# EasyEDA schematic SCH_junwoo-board_2025-07-26.json
TITLE: Junwoo_board; REV: 1.0; Date: 2025-03-15; Sheet: 1/1; Drawn By: junlee2577; Company: Lee Jun Woo
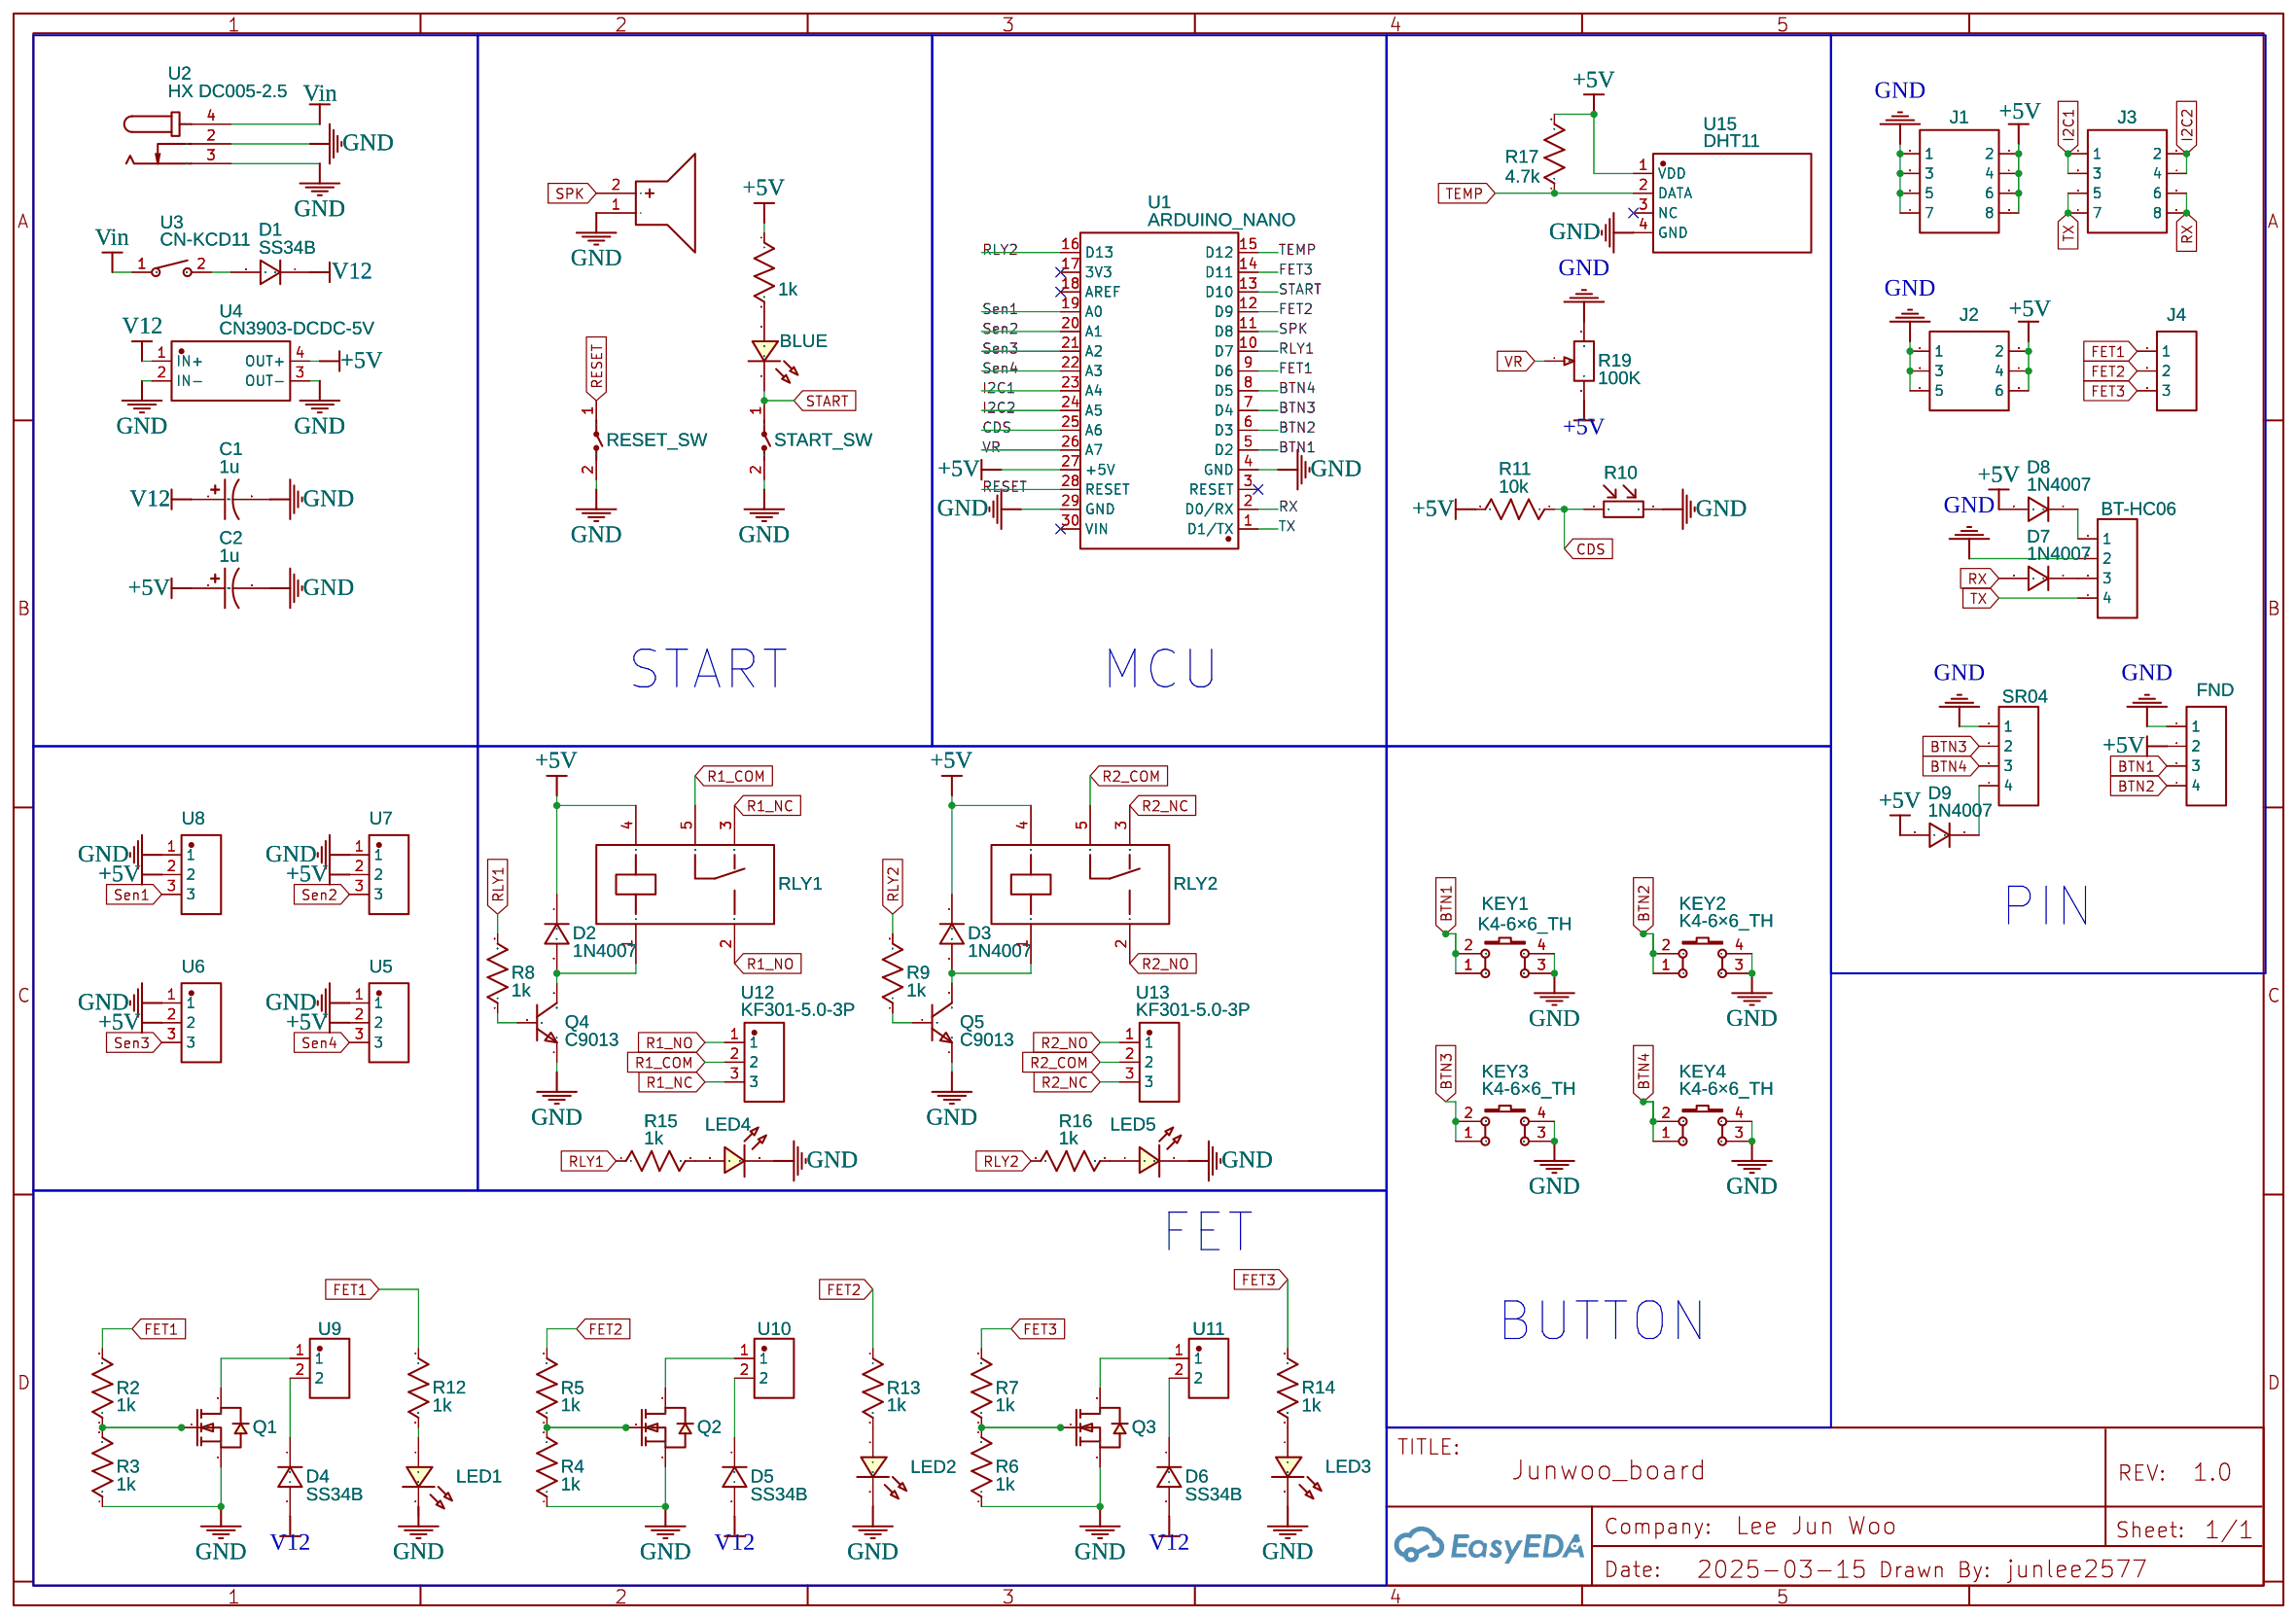
[diagram p0: schematic sheet]

## Parts
BLUE  LED-TH-3mm_B  [LED-TH_BD3.0_BLUE]
BT-HC06  HDR-M-2.54_1x4  [HDR-M-2.54_1X4]
BUZZER1  BUZZER  [BUZ-TH_BD12.0-P6.00-D0.9-RD]
C1  1u  [CAP-D6.3×F2.5]
C2  1u  [CAP-D6.3×F2.5]
D1  SS34B  [SMB_L4.6-W3.6-LS5.3-RD]
D2  1N4007  [DO-41_BD2.4-L4.7-P8.70-D0.9-RD]
D3  1N4007  [DO-41_BD2.4-L4.7-P8.70-D0.9-RD]
D4  SS34B  [SMB_L4.6-W3.6-LS5.3-RD]
D5  SS34B  [SMB_L4.6-W3.6-LS5.3-RD]
D6  SS34B  [SMB_L4.6-W3.6-LS5.3-RD]
D7  1N4007  [DO-41_BD2.4-L4.7-P8.70-D0.9-RD]
D8  1N4007  [DO-41_BD2.4-L4.7-P8.70-D0.9-RD]
D9  1N4007  [DO-41_BD2.4-L4.7-P8.70-D0.9-RD]
FND  HDR-M-2.54_1x4  [HDR-M-2.54_1X4]
J1  HDR-M-2.54_2x4  [HDR-M-2.54_2X4]
J2  HDR-M-2.54_2x3  [HDR-M-2.54_2X3]
J3  HDR-M-2.54_2x4  [HDR-M-2.54_2X4]
J4  HDR-M-2.54_1x3  [HDR-M-2.54_1X3]
KEY1  K4-6×6_TH  [KEY-TH_4P-L6.0-W6.0-P4.50-LS6.5]
KEY2  K4-6×6_TH  [KEY-TH_4P-L6.0-W6.0-P4.50-LS6.5]
KEY3  K4-6×6_TH  [KEY-TH_4P-L6.0-W6.0-P4.50-LS6.5]
KEY4  K4-6×6_TH  [KEY-TH_4P-L6.0-W6.0-P4.50-LS6.5]
LED1  LED-TH-5mm_B  [LED-TH_BD5.0_BLUE]
LED2  LED-TH-5mm_B  [LED-TH_BD5.0_BLUE]
LED3  LED-TH-5mm_B  [LED-TH_BD5.0_BLUE]
LED4  LED-TH-5mm_B  [LED-TH_BD5.0_BLUE]
LED5  LED-TH-5mm_B  [LED-TH_BD5.0_BLUE]
Q1  IRLZ44ZPBF  [TO-220-3_L10.0-W4.5-P2.54-L]
Q2  IRLZ44ZPBF  [TO-220-3_L10.0-W4.5-P2.54-L]
Q3  IRLZ44ZPBF  [TO-220-3_L10.0-W4.5-P2.54-L]
Q4  C9013  [2SC9013-ED]
Q5  C9013  [2SC9013-ED]
R1  1k  [R_AXIAL-0.4]
R2  1k  [R_AXIAL-0.4]
R3  1k  [R_AXIAL-0.4]
R4  1k  [R_AXIAL-0.4]
R5  1k  [R_AXIAL-0.4]
R6  1k  [R_AXIAL-0.4]
R7  1k  [R_AXIAL-0.4]
R8  1k  [R_AXIAL-0.4]
R9  1k  [R_AXIAL-0.4]
R10  GL5528(10-20)_C520869  [RES-TH_L5.1-W4.3-P3.40-D0.5]
R11  10k  [R_AXIAL-0.4]
R12  1k  [R_AXIAL-0.4]
R13  1k  [R_AXIAL-0.4]
R14  1k  [R_AXIAL-0.4]
R15  1k  [R_AXIAL-0.4]
R16  1k  [R_AXIAL-0.4]
R17  4.7k  [R_AXIAL-0.4]
R19  100K  [RV09AF]
RESET_SW  TS-1001-AR04326  [SW-TH_L6.0-W3.5-P6.50]
RLY1  5V-12V SRD05VDCSLC  [RELAY-TH_SRD-XXVDC-XL-C]
RLY2  5V-12V SRD05VDCSLC  [RELAY-TH_SRD-XXVDC-XL-C]
SR04  HDR-M-2.54_1x4  [HDR-M-2.54_1X4]
START_SW  TS-1001-AR04326  [SW-TH_L6.0-W3.5-P6.50]
U1  ARDUINO_NANO  [COMM-TH_ARDUINO_NANO]
U2  HX DC005-2.5  [DC-IN-TH_HX-DC005-2.5]
U3  CN-KCD11  [KEY-TH_CN-KCD11]
U4  CN3903-DCDC-5V  [CN3903 DCDC 5V]
U5  KF350-3.5-3P  [CONN-TH_3P-P3.50_KF350-3.5-3P]
U6  KF350-3.5-3P  [CONN-TH_3P-P3.50_KF350-3.5-3P]
U7  KF350-3.5-3P  [CONN-TH_3P-P3.50_KF350-3.5-3P]
U8  KF350-3.5-3P  [CONN-TH_3P-P3.50_KF350-3.5-3P]
U9  KF301-5.0-2P  [CONN-TH_P5.00_KF301-5.0-2P]
U10  KF301-5.0-2P  [CONN-TH_P5.00_KF301-5.0-2P]
U11  KF301-5.0-2P  [CONN-TH_P5.00_KF301-5.0-2P]
U12  KF301-5.0-3P  [CONN-TH_3P-P5.00_KF301-5.0-3P]
U13  KF301-5.0-3P  [CONN-TH_3P-P5.00_KF301-5.0-3P]
U15  DHT11  [SENSOR-TH_DHT11]

## Library data of the parts
BLUE = LED-TH-3mm_B: Manufacturer: EVERLIGHT(台湾亿光); Manufacturer Part: 204-10SUBC/S400-A4; Supplier Part: C86881; Supplier: LCSC; Contributor: LCEDA_Lib
BT-HC06 FND SR04 = HDR-M-2.54_1x4: Supplier Part: C124378; Supplier: LCSC; Contributor: LCEDA_Lib
BUZZER1 = BUZZER: Contributor: lcsc; Supplier: LCSC; Supplier Part: C9900014030; Manufacturer: null; Manufacturer Part: buzzer; JLCPCB Part Class: Extended Part
C1 C2 = CE_TH_D6.3×F2.5_US: Contributor: LCEDA_Lib
D1 D4-D6 = SS34B: Contributor: LCSC; Supplier Part: C169415; Supplier: LCSC; Manufacturer: 晶导微电子; JLCPCB Part Class: Extended Part
D2 D3 D7-D9 = 1N4007: Supplier: LCSC; Manufacturer: SEMTECH; Supplier Part: C106903; Contributor: LCEDA_Lib
J1 J3 = HDR-M-2.54_2x4: Supplier Part: C58363; Supplier: LCSC; Contributor: LCEDA_Lib
J2 = HDR-M-2.54_2x3: Supplier Part: C65114; Supplier: LCSC; Contributor: LCEDA_Lib
J4 = HDR-M-2.54_1x3: Supplier Part: C180248; Supplier: LCSC; Contributor: LCEDA_Lib
KEY1-KEY4 = K4-6×6_TH: Supplier: LCSC; Supplier Part: C136684; Manufacturer: 韩国韩荣; Manufacturer Part: K2-1102DP-E4SW-04; Contributor: LCEDA_Lib
LED1-LED5 = LED-TH-5mm_B: Supplier: LCSC; Contributor: LCEDA_Lib
Q1-Q3 = IRLZ44ZPBF: Contributor: LCSC; Supplier: LCSC; Supplier Part: C538200; Manufacturer: Infineon(英飞凌); JLCPCB Part Class: Extended Part
Q4 Q5 = C9013: Contributor: Fk229; libConvert: Yes; Add into BOM: Yes
R1-R9 R11-R17 = R_AXIAL-0.4_US: Contributor: LCEDA_Lib
R10 = GL5528(10-20)_C520869: Contributor: LCSC; Supplier: LCSC; Supplier Part: C520869; Manufacturer: JCHL(晶创和立); Manufacturer Part: GL5528(10-20); JLCPCB Part Class: Extended Part
R19 = RV09AF_schütze: Manufacturer: JML; Manufacturer Part: Potentiometer WH160-1-104; Supplier Part: C61836; Contributor: Willy Schütze
RESET_SW START_SW = TS-1001-AR04326: Contributor: LCSC; Supplier: LCSC; Supplier Part: C720481; Manufacturer: XUNPU(讯普); JLCPCB Part Class: Extended Part
RLY1 RLY2 = SRD-05VDC-SL-C: Supplier: LCSC; Manufacturer: 松乐; Supplier Part: C35449; JLCPCB Part Class: Extended Part; Contributor: a.t.whalley
U1 = ARDUINO_NANO: Contributor: lcsc; Supplier: LCSC; Supplier Part: C9900017879; Manufacturer: null; JLCPCB Part Class: Extended Part
U2 = HX DC005-2.5: Supplier: LCSC; Supplier Part: C18357599; Manufacturer: hanxia(韩下); Contributor: lcsc; JLCPCB Part Class: Extended Part
U3 = CN-KCD11: Contributor: LCSC; Supplier: LCSC; Supplier Part: C2926030; Manufacturer: null; JLCPCB Part Class: Extended Part
U4 = CN3903-DCDC-STEPDOWN-5V: Supplier: Aliexpress; link: https://www.aliexpress.com/item/1005002830334910.html?spm=a2g0s.9042311.0.0.251d4c4ddfGCCY; Contributor: marcelomanzo
U5-U8 = KF350-3.5-3P: Contributor: LCSC; Supplier: LCSC; Supplier Part: C474893; Manufacturer: KEFA(科发); JLCPCB Part Class: Extended Part
U9-U11 = KF301-5.0-2P: Contributor: LCSC; Supplier: LCSC; Supplier Part: C474881; Manufacturer: KEFA(科发); JLCPCB Part Class: Extended Part
U12 U13 = KF301-5.0-3P: Contributor: LCSC; Supplier: LCSC; Supplier Part: C474882; Manufacturer: KEFA(科发); JLCPCB Part Class: Extended Part
U15 = DHT11: Contributor: LCSC; Supplier: LCSC; Supplier Part: C117051; Manufacturer: 广州奥松; JLCPCB Part Class: Extended Part

## Nets
+5V: C2.1 D2.1 D3.1 D8.2 D9.2 FND.2 J1.2 J1.4 J1.6 J1.8 J2.2 J2.4 J2.6 R1.1 R11.2 R17.2 R19.3(1) RLY1.4 RLY2.4 U1.27(+5V) U4.4(OUT+) U5.2 U6.2 U7.2 U8.2 U15.1(VDD)
GND: BT-HC06.2 BUZZER1.1(-) C1.2 C2.2 FND.1 J1.1 J1.3 J1.5 J1.7 J2.1 J2.3 J2.5 KEY1.3 KEY1.4 KEY2.3 KEY2.4 KEY3.3 KEY3.4 KEY4.3 KEY4.4 LED1.2 LED2.2 LED3.2 LED4.2 LED5.2 Q1.3(S) Q2.3(S) Q3.3(S) Q4.1(E) Q5.1(E) R3.1 R4.1 R6.1 R10.2 R19.2(3) RESET_SW.2 SR04.1 START_SW.2 U1.4(GND) U1.29(GND) U2.2 U2.3 U4.2(IN-) U4.3(OUT-) U5.1 U6.1 U7.1 U8.1 U15.4(GND)
V12: C1.1 D1.1(C) D4.2(A) D5.2(A) D6.2(A) U4.1(IN+)
Vin: U2.4 U3.1
BTN1: FND.3 KEY1.1 KEY1.2 U1.5(D2)
BTN2: FND.4 KEY2.1 KEY2.2 U1.6(D3)
BTN3: KEY3.1 KEY3.2 SR04.2 U1.7(D4)
BTN4: KEY4.1 KEY4.2 SR04.3 U1.8(D5)
CDS: R10.1 R11.1 U1.25(A6)
FET1: J4.1 R2.2 R12.1 U1.9(D6)
FET2: J4.2 R5.2 R13.1 U1.12(D9)
FET3: J4.3 R7.2 R14.1 U1.14(D11)
I2C1: J3.1 J3.3 U1.23(A4)
I2C2: J3.2 J3.4 U1.24(A5)
R1_COM: RLY1.5 U12.2
R1_NC: RLY1.3 U12.3
R1_NO: RLY1.2 U12.1
R2_COM: RLY2.5 U13.2
R2_NC: RLY2.3 U13.3
R2_NO: RLY2.2 U13.1
RESET: RESET_SW.1 U1.28(RESET)
RLY1: R8.2 R15.1 U1.10(D7)
RLY2: R9.2 R16.1 U1.16(D13)
RX: D7.2 J3.6 J3.8 U1.2(D0/RX)
Sen1: U1.19(A0) U8.3
Sen2: U1.20(A1) U7.3
Sen3: U1.21(A2) U6.3
Sen4: U1.22(A3) U5.3
SPK: BUZZER1.2(+) U1.11(D8)
START: BLUE.2 START_SW.1 U1.13(D10)
TEMP: R17.1 U1.15(D12) U15.2(DATA)
TX: BT-HC06.4 J3.5 J3.7 U1.1(D1/TX)
VR: R19.1(2) U1.26(A7)
Net-(BLUE-1): BLUE.1 R1.2
Net-(BT-HC06-1): BT-HC06.1 D8.1
Net-(BT-HC06-3): BT-HC06.3 D7.1
Net-(D1-2): D1.2(A) U3.2
Net-(D2-2): D2.2 Q4.3(C) RLY1.1
Net-(D3-2): D3.2 Q5.3(C) RLY2.1
Net-(D4-1): D4.1(C) U9.2
Net-(D5-1): D5.1(C) U10.2
Net-(D6-1): D6.1(C) U11.2
Net-(D9-1): D9.1 SR04.4
Net-(LED1-1): LED1.1 R12.2
Net-(LED2-1): LED2.1 R13.2
Net-(LED3-1): LED3.1 R14.2
Net-(LED4-1): LED4.1 R15.2
Net-(LED5-1): LED5.1 R16.2
Net-(Q1-1): Q1.1(G) R2.1 R3.2
Net-(Q1-2): Q1.2(D) U9.1
Net-(Q2-1): Q2.1(G) R4.2 R5.1
Net-(Q2-2): Q2.2(D) U10.1
Net-(Q3-1): Q3.1(G) R6.2 R7.1
Net-(Q3-2): Q3.2(D) U11.1
Net-(Q4-2): Q4.2(B) R8.1
Net-(Q5-2): Q5.2(B) R9.1

Not connected (* = marked no-connect by the designer): U1 3(RESET)* 17(3V3)* 18(AREF)* 30(VIN)*; U15 3(NC)*

## Notes on the sheet
- START
- MCU
- 내부센서
- 전원부
- PIN
- 릴레이
- 센서부
- FET출력
- BUTTON
